# EAGLE design Main_board_rev21_bottom_image (EAGLE 9.1.1)
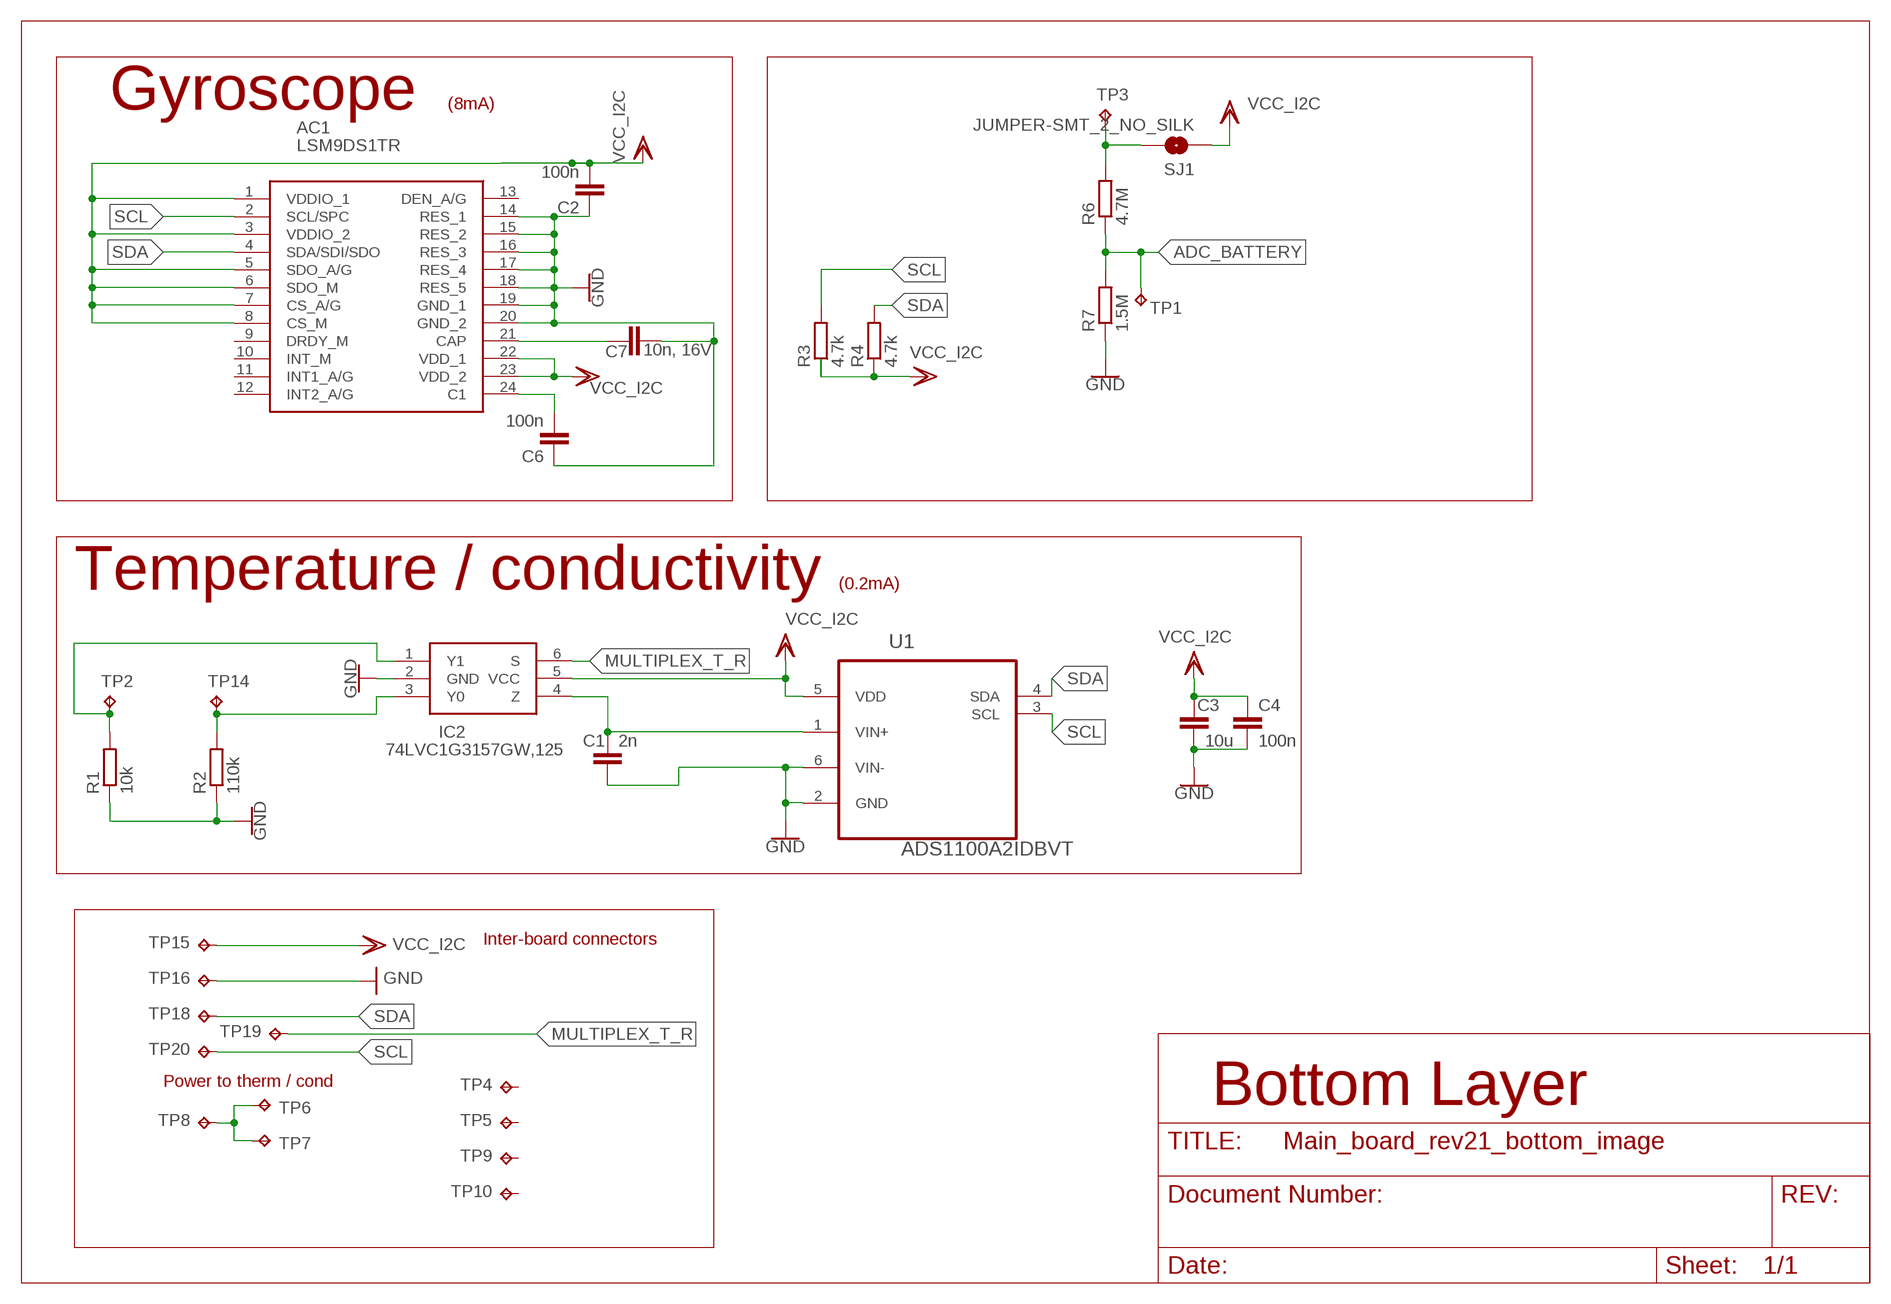
[diagram p0: schematic, sheet 1]

## Parts
AC1  LSM9DS1TR  [LGA-24L(3X3.5X1MM)]
C1  2n  C-EUC0603K  [C0603K]
C2  100n  C-EUC0603K  [C0603K]
C3  10u  C-EUC0603K  [C0603K]
C4  100n  C-EUC0603K  [C0603K]
C6  100n  C-EUC0603K  [C0603K]
C7  10n, 16V  C-EUC0603K  [C0603K]
IC2  74LVC1G3157GW,125  [SOT65P210X110-6N]
R1  10k  R-EU_R0603  [R0603]
R2  110k  R-EU_R0603  [R0603]
R3  4.7k  R-EU_R0603  [R0603]
R4  4.7k  R-EU_R0603  [R0603]
R6  4.7M  R-EU_R0603  [R0603]
R7  1.5M  R-EU_R0603  [R0603]
SJ1  JUMPER-SMT_2_NO_SILK  [SMT-JUMPER_2_NO_SILK]
TP1  TP  [TEST_PAD_1MM]
TP2  TP  [TEST_PAD_1MM]
TP3  TP  [TEST_PAD_1MM]
TP4  TP  [TEST_PAD_1MM]
TP5  TP  [TEST_PAD_1MM]
TP6  TP  [TEST_PAD_1MM]
TP7  TP  [TEST_PAD_1MM]
TP8  TP  [TEST_PAD_1MM]
TP9  TP  [TEST_PAD_1MM]
TP10  TP  [TEST_PAD_1MM]
TP14  TP  [TEST_PAD_1MM]
TP15  TP  [TEST_PAD_1MM]
TP16  TP  [TEST_PAD_1MM]
TP18  TP  [TEST_PAD_1MM]
TP19  TP  [TEST_PAD_1MM]
TP20  TP  [TEST_PAD_1MM]
U1  ADS1100A2IDBVT  [SOT95P280X145-6N]

## Nets
ADC_BATTERY: R6.1 R7.2 TP1.P$1(TP)
COND: IC2.1(Y1) R1.2 TP2.P$1(TP)
GND: AC1.14(RES_1) AC1.15(RES_2) AC1.16(RES_3) AC1.17(RES_4) AC1.18(RES_5) AC1.19(GND_1) AC1.20(GND_2) C1.2 C2.1 C3.1 C4.2 C6.1 C7.2 IC2.2(GND) R1.1 R2.1 R7.1 TP16.P$1(TP) U1.2(GND) U1.6(VIN-)
MULTIPLEX_T_R: IC2.6(S) TP19.P$1(TP)
N$1: C1.1 IC2.4(Z) U1.1(VIN+)
N$2: TP6.P$1(TP) TP7.P$1(TP) TP8.P$1(TP)
N$3: R6.2 SJ1.2 TP3.P$1(TP)
N$16: AC1.21(CAP) C7.1
N$18: AC1.24(C1) C6.2
SCL: AC1.2(SCL/SPC) R3.2 TP20.P$1(TP) U1.3(SCL)
SDA: AC1.4(SDA/SDI/SDO) R4.2 TP18.P$1(TP) U1.4(SDA)
THERM: IC2.3(Y0) R2.2 TP14.P$1(TP)
VDD: AC1.1(VDDIO_1) AC1.3(VDDIO_2) AC1.5(SDO_A/G) AC1.6(SDO_M) AC1.7(CS_A/G) AC1.8(CS_M) AC1.22(VDD_1) AC1.23(VDD_2) C2.2 C3.2 C4.1 IC2.5(VCC) R3.1 R4.1 SJ1.1 TP15.P$1(TP) U1.5(VDD) ; supply symbol labelled VCC_I2C
Unconnected: AC1.9(DRDY_M) AC1.10(INT_M) AC1.11(INT1_A/G) AC1.12(INT2_A/G) AC1.13(DEN_A/G) TP4.P$1(TP) TP5.P$1(TP) TP9.P$1(TP) TP10.P$1(TP)

## Notes on the sheet
- Gyroscope | (8mA)
- Temperature / conductivity | (0.2mA)
- Inter-board connectors
- Power to therm / cond
- Bottom Layer

## Library data of the parts
AC1 = SamacSys_Parts:LSM9DS1TR: iNEMO Inertial 3D Accel/Gyro/Magn. LGA24 STMicroelectronics LSM9DS1TR 3-Axis Accelerometer, Gyroscope & Magnetometer, 0 400 kHz, 1.9 3.6 V Source: Datasheet <https://componentsearchengine.com/Datasheets/1/LSM9DS1TR.pdf>; DESCRIPTION: iNEMO Inertial 3D Accel/Gyro/Magn. LGA24 STMicroelectronics LSM9DS1TR 3-Axis Accelerometer, Gyroscope & Magnetometer, 0 400 kHz, 1.9 3.6 V; HEIGHT: mm; MANUFACTURER_NAME: STMicroelectronics; MANUFACTURER_PART_NUMBER: LSM9DS1TR; MOUSER_PART_NUMBER: 511-LSM9DS1TR
C1-C4 C6 C7 = resistor:C-EU: CAPACITOR, European symbol
IC2 = SamacSys_Parts:74LVC1G3157GW,125: Nexperia 74LVC1G3157GW,125, Multiplexer Single 2:1, 3.3 V, 6-Pin TSSOP Source: Datasheet <https://componentsearchengine.com/Datasheets/1/74LVC1G3157GW,125.pdf>; DESCRIPTION: Nexperia 74LVC1G3157GW,125, Multiplexer Single 2:1, 3.3 V, 6-Pin TSSOP; HEIGHT: 1.1mm; MANUFACTURER_NAME: Nexperia; MANUFACTURER_PART_NUMBER: 74LVC1G3157GW,125; MOUSER_PART_NUMBER: 771-LVC1G3157GW125
R1-R4 R6 R7 = rcl:R-EU_: RESISTOR, European symbol; SPICEPREFIX: R
SJ1 = SparkFun-Jumpers:JUMPER-SMT_2_NO: Normally open jumper This jumper has two pads in close proximity to each other. Apply solder to close the connection. Round pads are easier to solder for beginners, but are a lot larger. SparkFun Product that uses the round pads: SparkFun EL Sequencer <https://www.sparkfun.com/products/12781>
TP1-TP10 TP14-TP16 TP18-TP20 = 0_my_lib:TP: Test pad
U1 = 0_my_lib:ADS1100A2IDBVT: Self-Calibrating, 16-Bit ANALOG-TO-DIGITAL CONVERTER; MPN: ADS1100A2IDBVT; OC_FARNELL: 1206858; OC_NEWARK: 20H0712; PACKAGE: SOT-23-6; SUPPLIER: Texas Instruments

## Board
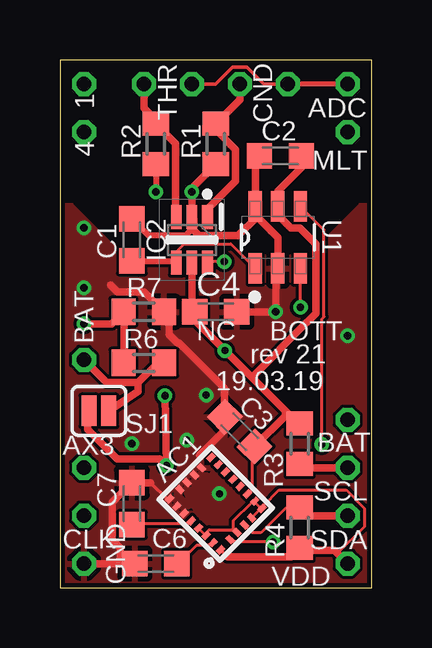
[diagram p1: board, top side]
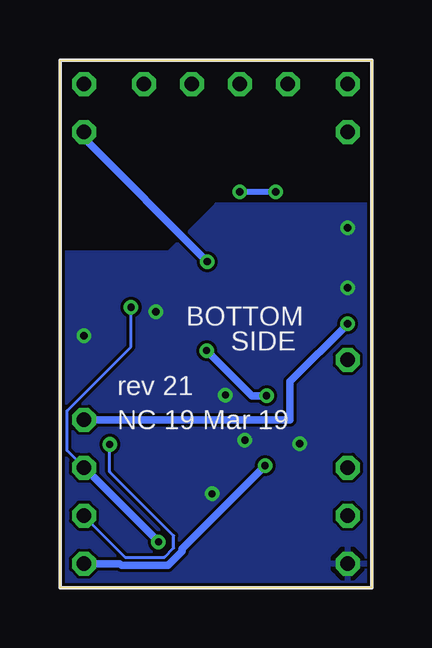
[diagram p2: board, bottom side, seen from below]

Size 13 x 22 mm. Coordinates in mm from the lower left corner, seen from the top.
Outline: 0,0 13,0 13,22 0,22 0,0
Copper layers (1*16): Top 0.035mm / dielectric 0.8mm / Bottom 0.035mm
Design rules "china_jlcpcb_rev2": minimum track width 5mil, minimum drill 0.3mm, track to track 5mil, track to pad 5mil, pad to pad 5mil, via to via 5mil, smd to smd 5mil, copper to edge 0.2mm, drill to drill 5mil, minimum pad ring 6mil, minimum via ring 6mil, stop-mask expansion 0.5mm, vias tented up to drill 0.35mm, thermal gap 8mil

### Footprints (pad centres in the part's own frame; a part is rotated, then mirrored left to right if it is on the bottom)
LGA-24L(3X3.5X1MM) = smd 0.23 x 0.35: 1 -1.505,1.225; 6 -1.505,-1.225; 7 -1.075,-1.225; 8 -0.645,-1.225; 9 -0.215,-1.225; 10 0.215,-1.225; 11 0.645,-1.225; 12 1.075,-1.225; 13 1.505,-1.225; 18 1.505,1.225; 19 1.075,1.225; 20 0.645,1.225; 21 0.215,1.225; 22 -0.215,1.225; 23 -0.645,1.225; 24 -1.075,1.225 | smd 0.35 x 0.23: 2 -1.475,0.645; 3 -1.475,0.215; 4 -1.475,-0.215; 5 -1.475,-0.645; 14 1.475,-0.645; 15 1.475,-0.215; 16 1.475,0.215; 17 1.475,0.645
C0603K = smd 1.05 x 1.08: 1 -0.875,0; 2 0.875,0
SOT65P210X110-6N = smd 1 x 0.45: 1 -0.95,0.65; 2 -0.95,0; 3 -0.95,-0.65; 4 0.95,-0.65; 5 0.95,0; 6 0.95,0.65
R0603 = smd 1 x 1.1: 1 -0.85,0; 2 0.85,0
SMT-JUMPER_2_NO_SILK = smd 0.635 x 1.27: 1 -0.406,0; 2 0.406,0
TEST_PAD_1MM = drill 0.6 pad 1 octagon: P$1 0,0
SOT95P280X145-6N = smd 1.27 x 0.559: 1 -1.295,0.94; 2 -1.295,0; 3 -1.295,-0.94; 4 1.295,-0.94; 5 1.295,0; 6 1.295,0.94

### Placement (x,y rotation side)
AC1  6.5,3.5 135 top
C1  3,14.5 90 top
C2  9.2,18 0 top
C3  7.5,6.5 315 top
C4  6.5,11.5 0 top
C6  4,1 0 top
C7  3,3.5 90 top
IC2  5.5,14.5 270 top
R1  6.5,18.5 90 top
R2  4,18.5 90 top
R3  10,6 270 top
R4  10,2.5 90 top
R6  3.5,9.37 0 top
R7  3.5,11.5 180 top
SJ1  1.62,7.37 0 top
TP1  12,7 0 top
TP2  7.5,21 0 top
TP3  1,9.5 0 bottom
TP4  1,21 0 top
TP5  1,19 0 top
TP6  5.5,21 0 top
TP7  9.5,21 0 top
TP8  12,21 0 top
TP9  1,5 0 top
TP10  1,3 0 top
TP14  3.5,21 0 top
TP15  12,1 0 top
TP16  1,1 0 top
TP18  12,3 0 bottom
TP19  12,19 0 top
TP20  12,5 0 top
U1  9.09,14.6 90 top

### Tracks (layer width: path | path; a pad name or v marks a point on that pad's centre or on a via)
ADC_BATTERY  (via drill 0.3)
  Top 0.127: 2.54,9.4 R6.1 2.67,9.4 2.67,11.43 R7.2
  Top 0.305: R6.1 2.67,9.39 2.67,11.43 | v1,11 2.15,11 R7.2
  Bottom 0.305: TP1.P$1 3.41,7 3.41,8.59 v1,11
COND
  Top 0.305: TP2.P$1 7.5,20.35 R1.2 6.5,19.09 7.33,18.27 7.33,16.95 6.15,15.78 IC2.1
GND  (via drill 0.3, 0.3 pad 0.6)
  Top 0.127: 3.94,17.53 R2.1 | 8.26,15.49 8.87,14.87 | 8.26,15.49 8.26,15.88 U1.6 8.26,15.49 | 5.59,14.99 5.59,15.37 IC2.2 5.58,15.02 5.59,14.99 | 5.59,14.99 5.84,14.73 7.49,14.73 | 8.26,15.49 7.49,14.73 | 7.49,14.73 7.43,14.67 | C6.1 3.05,1.02 2.16,1.02 1.02,1.02 TP16.P$1 | 4.95,3.43 AC1.19 | 5.21,3.17 AC1.20 | 4.57,3.68 AC1.18 4.48,3.69 | 5.08,4.06 AC1.17 4.95,4.19 | 5.33,4.32 AC1.16 5.33,4.45 | 5.97,4.95 AC1.14 | 5.59,4.7 AC1.15 | 5.84,5.46 5.94,5.56 6.86,6.48 6.86,7 6.86,7.11 C3.1 6.86,7.24 6.86,7.5 | 2.16,3.56 2.92,4.32 C7.2 | 2.12,12.62 2.41,12.32
  Top 0.152: 3.79,4.38 4.47,3.7 AC1.18 4.61,3.7 | 5.89,5.51 5.94,5.56 | AC1.20 5.17,3.09
  Top 0.254: R2.1 v4,16.5 | C1.2 3.68,14.7 5.26,14.7 5.58,15.02
  Top 0.305: TP16.P$1 2.5,1 | 2.5,1 C6.1 | 2.5,1 2.5,1.67 2.18,1.98 2.18,3.56 C7.2 3.79,4.38 | 6.86,7.5 6.86,8.31 4.97,10.2 4.91,10.2 4.56,10.56 4.56,11.29 R7.1 3.52,12.33 2.4,12.33 2.12,12.62 | C2.1 8.15,17.83 U1.6 | R1.1 5.5,16.65 v5.5,16.5 IC2.2 5.49,14.99 5.81,14.67 7.43,14.67 | 5.59,15.07 5.59,15.37 | U1.6 8.15,15.39 7.49,14.73 | 8.8,14.87 8.7,14.98 | U1.6 8.15,15.53 8.7,14.98 | 8.7,14.98 9.09,14.59 U1.2 9,13.21 v9,11.5 C4.2 | 6.86,7 6.86,6.54 5.82,5.5
  Bottom 0.254: v4,16.5 v5.5,16.5
  other vias: 1,15 12,10.5 3,6 6.65,3.91 6.1,8.03 5.28,6.15 1,12.5
  pour Bottom: 0,16 6.5,16 8.5,14 13,14 13,0 0,0
  pour Top: 0,16 0.5,16 2.5,14 10,14 10.5,14 12.5,16 13,16 13,0 0,0
MULTIPLEX_T_R  (via drill 0.3)
  Top 0.127: v6.86,13.59 6.22,13.59 IC2.6
  Bottom 0.305: TP19.P$1 12,18.73 v6.86,13.59
N$1
  Top 0.127: IC2.4 4.95,13.65 4.95,14.1 5.18,14.33 7.13,14.33 U1.1
  Top 0.254: C1.1 4.78,13.62 IC2.4
  Top 0.305: C1.1 3.08,13.55
N$2
  Top 0.152: TP7.P$1 8.5,21 7.79,21.71 7.21,21.71 6.5,21 TP6.P$1
  Top 0.203: TP8.P$1 TP7.P$1
N$3
  Top 0.305: R6.2 4.09,9.37 3.27,8.54 | 3.27,8.54 1.96,8.54 TP3.P$1 | SJ1.2 3.27,8.18 3.27,8.54
N$16
  Top 0.127: C7.1 3.04,2.67 5.36,2.67 AC1.21
N$18
  Top 0.127: AC1.24 6.35,1.78 5.71,1.78 4.95,1.02 C6.2
SCL  (via drill 0.3)
  Top 0.127: v8.89,1.91 7.11,1.91 AC1.2 | v10.03,11.68 10.03,13.21 U1.3
  Top 0.305: R3.2 10.15,5 TP20.P$1
  Bottom 0.127: v8.89,1.91 11.94,4.95 TP20.P$1 12,5.01 12.24,5.26 12.7,5.71 12.7,7.37 10.03,10.03 v10.03,11.68
  Bottom 0.305: v8.89,1.91 12.24,5.26
SDA  (via drill 0.3)
  Top 0.127: AC1.4 7.98,2.33 8.03,2.29 8.38,2.29 9.4,3.3 9.91,3.3 R4.2 | v10.92,5.97 10.92,11.19 11.01,11.28 11.01,14.91 U1.4
  Top 0.305: R4.2 10.35,3 TP18.P$1
  Bottom 0.127: v10.92,5.97 10.92,4.83 8.26,2.16 8.26,1.65 8.64,1.27 10.29,1.27 11.94,2.92 TP18.P$1
THERM
  Top 0.127: 4.07,19.43 4.06,19.43 R2.2 | 4.83,15.5 4.83,15.47 IC2.3
  Top 0.305: TP14.P$1 3.5,20 4.07,19.43 | R2.2 4.83,18.52 4.83,15.5
VDD  (via drill 0.3)
  Top 0.127: 11.56,1.4 11.94,1.02 TP15.P$1 | 11.56,1.4 11.43,1.52 10.03,1.52 R4.1 9.93,1.55 9.69,1.31 | 8,2.92 AC1.5 8,2.92 | 8.38,3.3 AC1.6 | 8.13,3.56 AC1.7 | 8.38,3.3 AC1.6 | 8.13,3.56 8.09,3.59 | 8.13,3.56 AC1.7 | 6.1,2.16 AC1.23 | 7.37,2.41 AC1.3 7.37,2.41 | 8,4.06 8,5.84 C3.2 | 7.87,3.94 AC1.8 | 9.88,6.88 9.4,7.37 | 9.4,7.37 8,8.76 v6.88,9.88 5.59,11.18 | 9.4,7.24 9.4,7.37 | 11.56,1.4 12.7,2.54 12.7,3.3 11.94,4.06 9.14,4.06 8.51,3.43 AC1.6 | 8.38,3.3 8,2.92 | 8.38,3.3 AC1.6 | 8.38,3.3 8.13,3.56 | 8.13,3.56 AC1.7 | 8.38,3.3 AC1.6 | 6.1,2.16 5.84,2.41 AC1.22 | 6.1,2.16 AC1.23 | 7.24,2.41 6.22,2.41 6.1,2.29 AC1.23 | 7.24,2.41 7.37,2.41 | 7.24,2.41 7.24,2.79 8,3.56 AC1.7
  Top 0.152: AC1.1 7,1.27 | 8,4.06 7.87,3.94 | C4.1 5.5,11.38 5.5,11.26
  Top 0.305: TP15.P$1 11.45,1.55 9.93,1.55 | v4.38,8 v4.45,5.08 4.16,5.37 2.38,5.37 1.17,6.58 1.17,7.35 SJ1.1 | 9.91,6.85 R3.1 9.91,6.85 | 9.91,6.85 9.88,6.88 5.59,11.18 5.5,11.26 IC2.5 | 9.4,7.24 9.4,7.16 C3.2 8.09,5.86 | C2.2 10.07,17.52 9.09,16.54 U1.5 9.09,15.53 9.63,14.98 10,14.98 10.67,14.32 10.67,11.42 10.29,11.05 8,8.76 | 9.69,1.31 9.65,1.27 7,1.27
  Bottom 0.305: TP15.P$1 10.5,1 10.43,0.93 8.49,0.93 7.91,1.51 7.91,1.61 v4.45,5.08 | v4.38,8 5,8 v6.88,9.88

### Text on the board
tNames: THR | CND | 1 | ADC | 4 | MLT | BAT | NC | BOTT | rev 21 | 19.03.19 | AX3 | BAT | SCL | CLK | SDA | VDD | GND
bNames: BOTTOM | SIDE | rev 21 | NC 19 Mar 19